# EAGLE design canbus-proto2 (EAGLE 6.4)
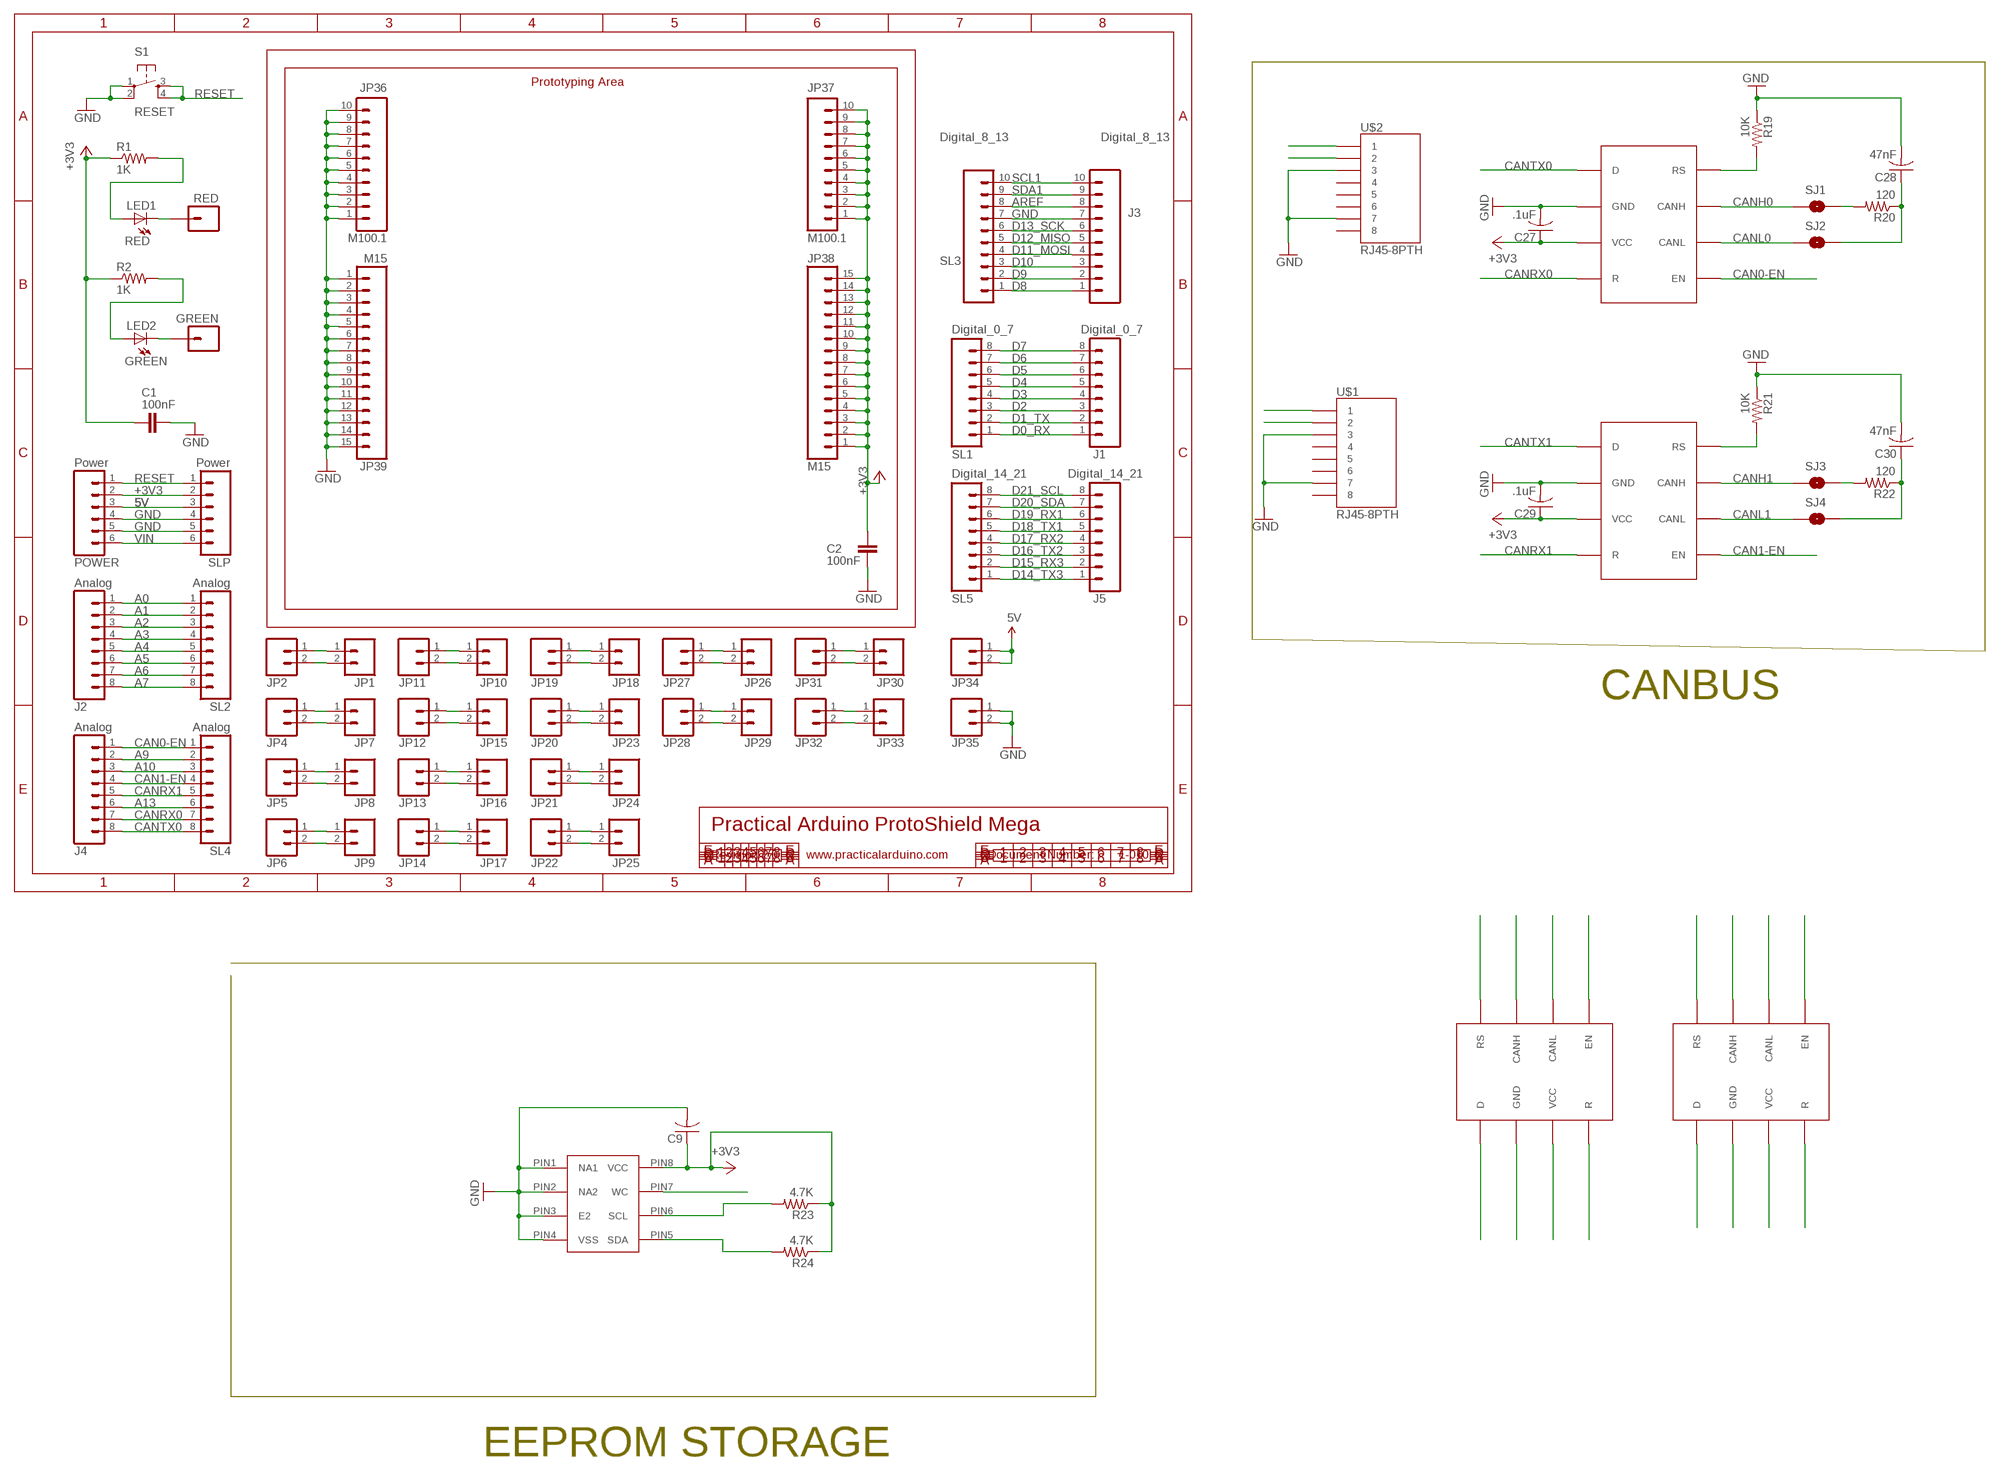
[diagram p0: schematic, sheet 1]

## Parts
C1  100nF  CAP0603-CAP  [0603-CAP]
C2  100nF  CAP0603-CAP  [0603-CAP]
C9  C-USC0603  [C0603]
C27  .1uF  C-USC0603  [C0603]
C28  47nF  C-USC0603  [C0603]
C29  .1uF  C-USC0603  [C0603]
C30  47nF  C-USC0603  [C0603]
GREEN  M01PTH  [1X01]
J1  Digital_0_7  M08  [1X08]
J2  Analog  M08  [1X08]
J3  Digital_8_13  M10"  [1X10]
J4  Analog  M08  [1X08]
J5  Digital_14_21  M08  [1X08]
JP1  M02PTH  [1X02]
JP2  M02PTH  [1X02]
JP4  M02PTH  [1X02]
JP5  M02PTH  [1X02]
JP6  M02PTH  [1X02]
JP7  M02PTH  [1X02]
JP8  M02PTH  [1X02]
JP9  M02PTH  [1X02]
JP10  M02PTH  [1X02]
JP11  M02PTH  [1X02]
JP12  M02PTH  [1X02]
JP13  M02PTH  [1X02]
JP14  M02PTH  [1X02]
JP15  M02PTH  [1X02]
JP16  M02PTH  [1X02]
JP17  M02PTH  [1X02]
JP18  M02PTH  [1X02]
JP19  M02PTH  [1X02]
JP20  M02PTH  [1X02]
JP21  M02PTH  [1X02]
JP22  M02PTH  [1X02]
JP23  M02PTH  [1X02]
JP24  M02PTH  [1X02]
JP25  M02PTH  [1X02]
JP26  M02PTH  [1X02]
JP27  M02PTH  [1X02]
JP28  M02PTH  [1X02]
JP29  M02PTH  [1X02]
JP30  M02PTH  [1X02]
JP31  M02PTH  [1X02]
JP32  M02PTH  [1X02]
JP33  M02PTH  [1X02]
JP34  M02PTH  [1X02]
JP35  M02PTH  [1X02]
JP36  M100.1  [1X10@1]
JP37  M100.1  [1X10@1]
JP38  M15  [1X15]
JP39  M15  [1X15]
LED1  RED  LED-RED0603  [LED-0603]
LED2  GREEN  LED-GREEN0603  [LED-0603]
POWER  Power  M06SIP  [1X06]
R1  1K  R-US_R0603  [R0603]
R2  1K  R-US_R0603  [R0603]
R19  10K  R-US_R0603  [R0603]
R20  120  R-US_R0603  [R0603]
R21  10K  R-US_R0603  [R0603]
R22  120  R-US_R0603  [R0603]
R23  4.7K  R-US_R0603  [R0603]
R24  4.7K  R-US_R0603  [R0603]
RED  M01PTH  [1X01]
S1  RESET  TAC_SWITCHPTH  [TACTILE-PTH]
SJ1  SOLDERJUMPERNO  [SJ_2S-NO]
SJ2  SOLDERJUMPERNO  [SJ_2S-NO]
SJ3  SOLDERJUMPERNO  [SJ_2S-NO]
SJ4  SOLDERJUMPERNO  [SJ_2S-NO]
SL1  Digital_0_7  M08  [1X08]
SL2  Analog  M08  [1X08]
SL3  Digital_8_13  M10"  [1X10]
SL4  Analog  M08  [1X08]
SL5  Digital_14_21  M08  [1X08]
SLP  Power  M06SIP  [1X06]
U$1  RJ45-8PTH  [RJ45-8]
U$2  RJ45-8PTH  [RJ45-8]
U$3  SN65HVD234  [SOIC8]
U$4  SN65HVD234  [SOIC8]
U$6  M24M02-DRMN6TP  [SOIC8]
U$7  SN65HVD234  [SOIC8]
U$8  SN65HVD234  [SOIC8]

## Nets
5V: JP34.1 JP34.2 POWER.3 SLP.3
+3V3: C1.1 C2.1 C9.1 C27.1 C29.1 JP37.1 JP37.2 JP37.3 JP37.4 JP37.5 JP37.6 JP37.7 JP37.8 JP37.9 JP37.10 JP38.1 JP38.2 JP38.3 JP38.4 JP38.5 JP38.6 JP38.7 JP38.8 JP38.9 JP38.10 JP38.11 JP38.12 JP38.13 JP38.14 JP38.15 POWER.2 R1.1 R2.1 R23.1 R24.1 SLP.2 U$6.PIN8(VCC) U$7.PIN3(VCC) U$8.PIN3(VCC)
A0: J2.1 SL2.1
A1: J2.2 SL2.2
A2: J2.3 SL2.3
A3: J2.4 SL2.4
A4: J2.5 SL2.5
A5: J2.6 SL2.6
A6: J2.7 SL2.7
A7: J2.8 SL2.8
A9: J4.2 SL4.2
A10: J4.3 SL4.3
A13: J4.6 SL4.6
AREF: J3.8 SL3.8
B1: U$3.PIN8(RS)
B2: U$3.PIN7(CANH)
B3: U$3.PIN6(CANL)
B4: U$3.PIN5(EN)
B5: U$3.PIN1(D)
B6: U$3.PIN2(GND)
B7: U$3.PIN3(VCC)
B8: U$3.PIN4(R)
B9: U$4.PIN8(RS)
B10: U$4.PIN7(CANH)
B11: U$4.PIN6(CANL)
B12: U$4.PIN5(EN)
B13: U$4.PIN4(R)
B14: U$4.PIN3(VCC)
B15: U$4.PIN2(GND)
B16: U$4.PIN1(D)
CAN0-EN: J4.1 SL4.1 U$7.PIN5(EN)
CAN1-EN: J4.4 SL4.4 U$8.PIN5(EN)
CANH0: SJ1.1 U$2.1 U$7.PIN7(CANH)
CANH1: SJ3.1 U$1.1 U$8.PIN7(CANH)
CANL0: SJ2.1 U$2.2 U$7.PIN6(CANL)
CANL1: SJ4.1 U$1.2 U$8.PIN6(CANL)
CANRX0: J4.7 SL4.7 U$7.PIN4(R)
CANRX1: J4.5 SL4.5 U$8.PIN4(R)
CANTX0: J4.8 SL4.8 U$7.PIN1(D)
CANTX1: JP32.2 JP33.2 U$8.PIN1(D)
D0_RX: J1.1 SL1.1
D1: JP10.2 JP11.2
D1_TX: J1.2 SL1.2
D2: J1.3 SL1.3
D3: J1.4 SL1.4
D4: J1.5 SL1.5
D5: J1.6 SL1.6
D6: J1.7 SL1.7
D7: J1.8 SL1.8
D8: J3.1 SL3.1
D9: J3.2 SL3.2
D10: J3.3 SL3.3
D11: JP10.1 JP11.1
D11_MOSI: J3.4 SL3.4
D12: JP18.2 JP19.2
D12_MISO: J3.5 SL3.5
D13: JP18.1 JP19.1
D13_SCK: J3.6 SL3.6
D14: JP26.2 JP27.2
D14_TX3: J5.1 SL5.1
D15: JP26.1 JP27.1
D15_RX3: J5.2 SL5.2
D16: JP30.2 JP31.2
D16_TX2: J5.3 SL5.3
D17: JP30.1 JP31.1
D17_RX2: J5.4 SL5.4
D18_TX1: J5.5 SL5.5 U$6.PIN7(WC)
D19_RX1: J5.6 SL5.6
D20_SDA: J5.7 R24.2 SL5.7 U$6.PIN5(SDA)
D21_SCL: J5.8 R23.2 SL5.8 U$6.PIN6(SCL)
D22: JP1.2 JP2.2
D23: JP1.1 JP2.1
GND: C1.2 C2.2 C9.2 C27.2 C28.2 C29.2 C30.2 J3.7 JP35.1 JP35.2 JP36.1 JP36.2 JP36.3 JP36.4 JP36.5 JP36.6 JP36.7 JP36.8 JP36.9 JP36.10 JP39.1 JP39.2 JP39.3 JP39.4 JP39.5 JP39.6 JP39.7 JP39.8 JP39.9 JP39.10 JP39.11 JP39.12 JP39.13 JP39.14 JP39.15 POWER.4 POWER.5 R19.1 R21.1 S1.1 S1.2 SL3.7 SLP.4 SLP.5 U$1.3 U$1.7 U$2.3 U$2.7 U$6.PIN1(NA1) U$6.PIN2(NA2) U$6.PIN3(E2) U$6.PIN4(VSS) U$7.PIN2(GND) U$8.PIN2(GND)
N$1: LED1.A R1.2
N$2: LED1.C RED.1
N$3: LED2.A R2.2
N$4: GREEN.1 LED2.C
N$203: R19.2 U$7.PIN8(RS)
N$337: JP4.1 JP7.1
N$338: JP4.2 JP7.2
N$339: JP5.1 JP8.1
N$340: JP5.2 JP8.2
N$341: JP6.1 JP9.1
N$342: JP6.2 JP9.2
N$343: JP12.1 JP15.1
N$344: JP12.2 JP15.2
N$345: JP13.1 JP16.1
N$346: JP13.2 JP16.2
N$347: JP14.1 JP17.1
N$348: JP14.2 JP17.2
N$349: JP20.1 JP23.1
N$350: JP20.2 JP23.2
N$351: JP21.1 JP24.1
N$352: JP21.2 JP24.2
N$353: JP22.1 JP25.1
N$354: JP22.2 JP25.2
N$355: JP28.1 JP29.1
N$356: JP28.2 JP29.2
N$357: JP32.1 JP33.1
N$359: C28.1 R20.1 SJ2.2
N$360: R20.2 SJ1.2
N$361: R21.2 U$8.PIN8(RS)
N$362: C30.1 R22.1 SJ4.2
N$363: R22.2 SJ3.2
RESET: POWER.1 S1.3 S1.4 SLP.1
SCL1: J3.10 SL3.10
SDA1: J3.9 SL3.9
VIN: POWER.6 SLP.6
Unconnected: U$1.4 U$1.5 U$1.6 U$1.8 U$2.4 U$2.5 U$2.6 U$2.8

## Notes on the sheet
- Prototyping Area
- CANBUS
- Practical Arduino ProtoShield Mega
- Revision 2.0 | www.practicalarduino.com | Document Number: | 1-010
- EEPROM STORAGE

## Library data of the parts
C1 C2 = SparkFun-Passives:CAP: Capacitor Standard 0603 ceramic capacitor, and 0.1" leaded capacitor.
C9 C27-C30 = rcl:C-US: CAPACITOR, American symbol
GREEN RED = SparkFun:M01: Header 1 Standard 1-pin 0.1" header. Use with straight break away headers (SKU : PRT-00116), right angle break away headers (PRT-00553), swiss pins (PRT-00743), machine pins (PRT-00117), and female headers (PRT-00115).
J1 J2 J4 J5 SL1 SL2 SL4 SL5 = SparkFun:M08: Header 8 Standard 8-pin 0.1" header. Use with straight break away headers (SKU : PRT-00116), right angle break away headers (PRT-00553), swiss pins (PRT-00743), machine pins (PRT-00117), and female headers (PRT-00115).
J3 SL3 = SparkFun-Connectors:M10: Header 10 Standard 10-pin 0.1" header. Use with straight break away headers (SKU : PRT-00116), right angle break away headers (PRT-00553), swiss pins (PRT-00743), machine pins (PRT-00117), and female headers (PRT-00115).
JP1 JP2 JP4-JP35 = SparkFun:M02: Header 2 Standard 2-pin 0.1" header. Use with straight break away headers (SKU : PRT-00116), right angle break away headers (PRT-00553), swiss pins (PRT-00743), machine pins (PRT-00117), and female headers (PRT-00115). Molex polarized connector foot print use with SKU : PRT-08233 with associated crimp pins and housings.
JP36 JP37 = SparkFun:M10: Header 10 Standard 10-pin 0.1" header. Use with straight break away headers (SKU : PRT-00116), right angle break away headers (PRT-00553), swiss pins (PRT-00743), machine pins (PRT-00117), and female headers (PRT-00115).
JP38 JP39 = SparkFun-Connectors:M15: Header 15 Standard 15-pin 0.1" header. Use with straight break away headers (SKU : PRT-00116), right angle break away headers (PRT-00553), swiss pins (PRT-00743), machine pins (PRT-00117), and female headers (PRT-00115).
LED1 = SparkFun-LED:LED-RED: Assorted Red LEDs LilyPad 1206- DIO-09912 1206- DIO-00809 0603- DIO-00819; PROD_ID: DIO-00819
LED2 = SparkFun-LED:LED-GREEN: Various green LEDs 0603- DIO-00821 LARGE- DIO-00862 LILYPAD- DIO-09910; PROD_ID: DIO-00821
POWER SLP = SparkFun:M06: Header 6 Standard 6-pin 0.1" header. Use with straight break away headers (SKU : PRT-00116), right angle break away headers (PRT-00553), swiss pins (PRT-00743), machine pins (PRT-00117), and female headers (PRT-00115). Molex polarized connector foot print use with SKU : PRT-08094 with associated crimp pins and housings. NOTES ON THE VARIANTS LOCK and LOCK_LONGPADS... This footprint was designed to help hold the alignment of a through-hole component (i.e. 6-pin header) while soldering it into place. You may notice that each hole has been shifted either up or down by 0.005 of an inch from it's more standard position (which is a perfectly straight line). This slight alteration caused the pins (the squares in the middle) to touch the edges of the holes. Because they are alternating, it causes a "brace" to hold the component in place. 0.005 has proven to be the perfect amount of "off-center" position when using our standard breakaway headers. Although looks a little odd when you look at the bare footprint, once you have a header in there, the alteration is very hard to notice. Also, if you push a header all the way into place, it is covered up entirely on the bottom side. This idea of altering the position of holes to aid alignment will be further integrated into the Sparkfun Library for other footprints. It can help hold any component with 3 or more connection pins.
R1 R2 R19-R24 = rcl:R-US_: RESISTOR, American symbol
S1 = SparkFun:TAC_SWITCH: Momentary Switch Button commonly used for reset or general input. Spark Fun Electronics SKU : COM-00097
SJ1-SJ4 = SparkFun-Passives:SOLDERJUMPER: Solder Jumper Standard SMD solder jumper. Used to automate production. Two varients : Normally Open and Normally Closed are the same, but have different paste layers. NC will have a large amount of paste and should jumper during reflow.
U$1 U$2 = SparkFun-Connectors:RJ45-8: RJ45 Jack Simple RJ45, 8-pin connection - connector for common Cat5, Cat5e, and Cat6 Ethernet cables. Footprint not yet proven in production. Connector sku is PRT-00643; Breakout PCB sku is BOB-00716.
U$3 U$4 U$7 U$8 = ck_custom:SN65HVD234
U$6 = ck_custom:M24M02-DRMN6TP

## Board
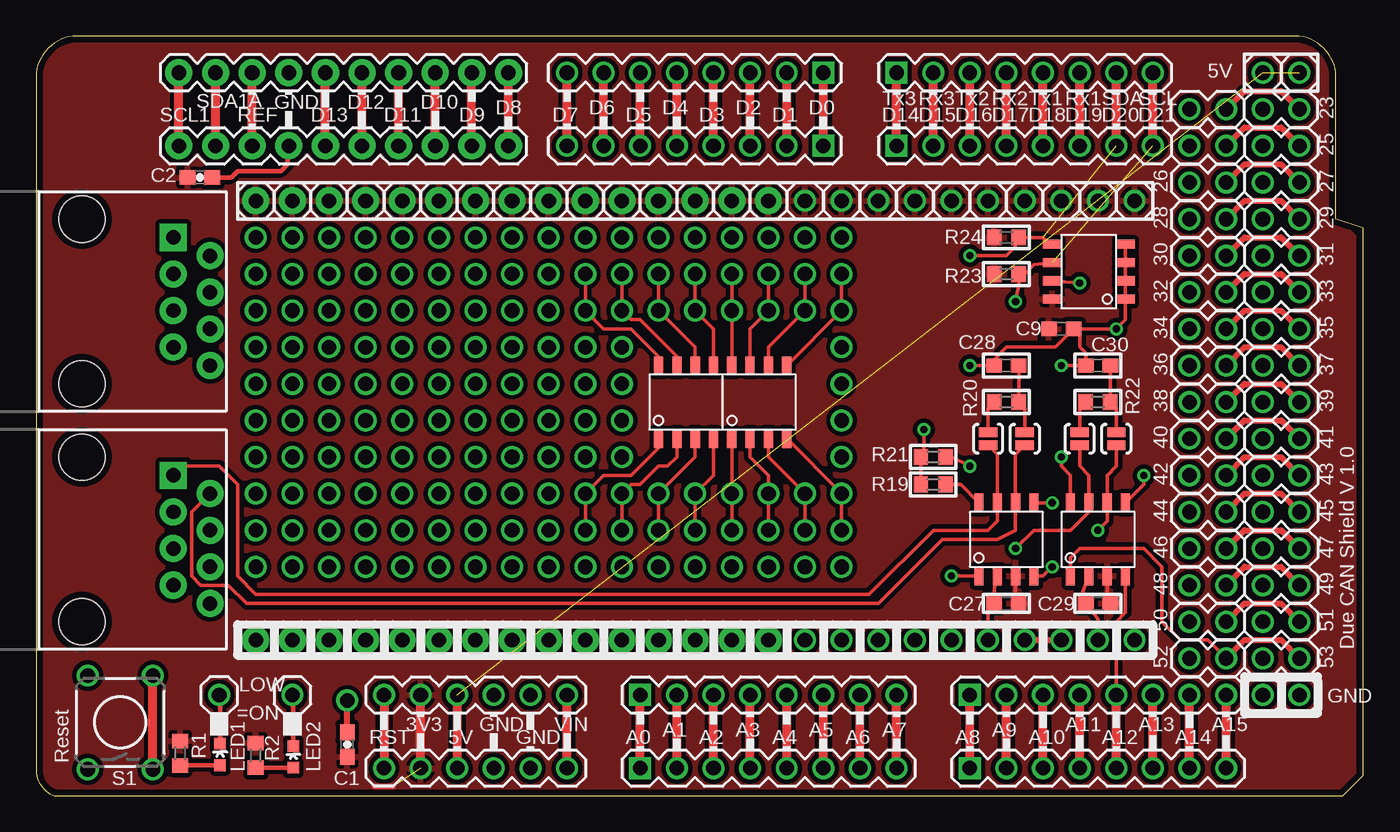
[diagram p1: board, top side]
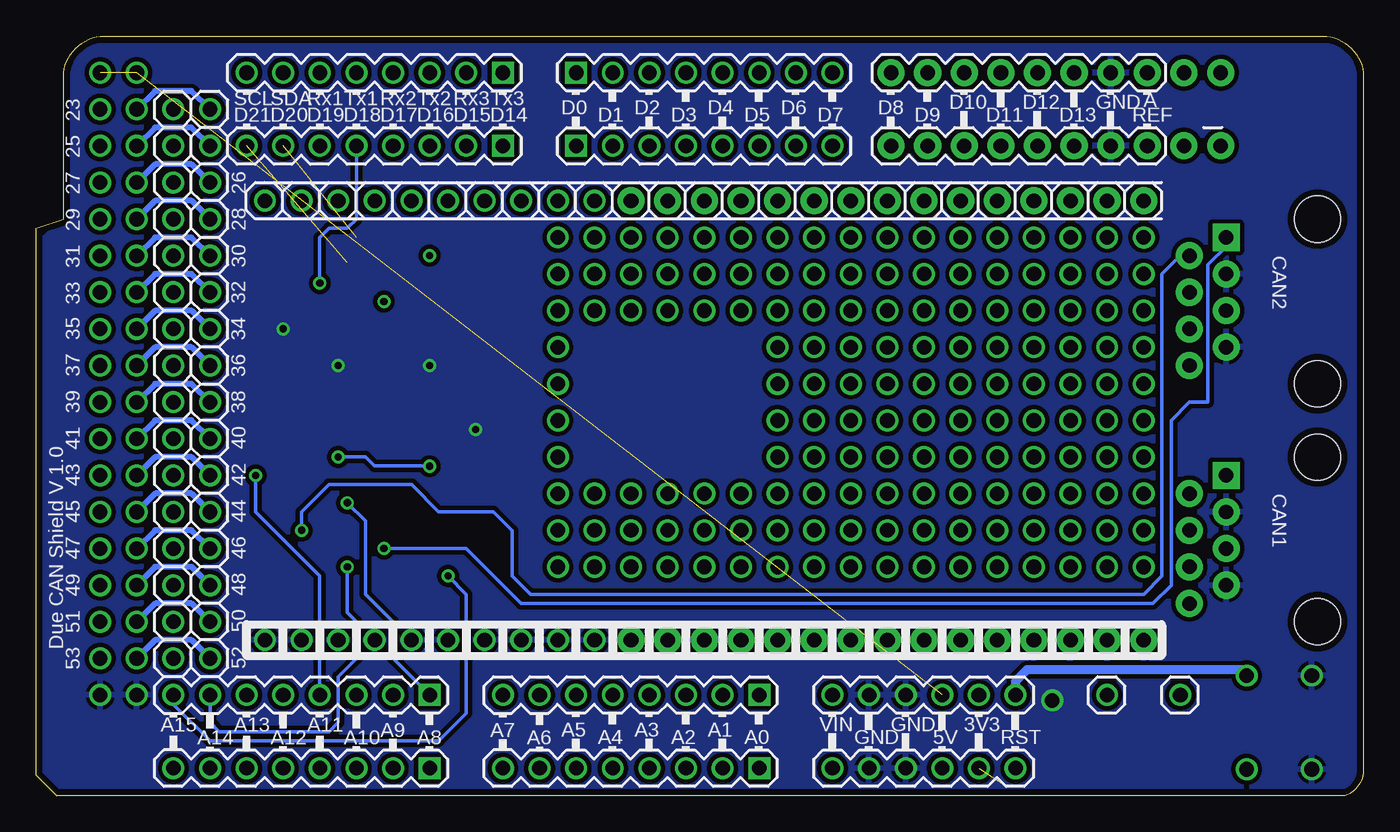
[diagram p2: board, bottom side, seen from below]

Size 92.08 x 52.71 mm. Coordinates in mm from the lower left corner, seen from the top.
Outline: 0,1.91 arc74 1.27,0 90.65,0 92.08,1.43 92.08,39.37 90.17,40.01 90.17,50.16 arc74 87.63,52.71 2.54,52.71 arc74 0,50.16 0,1.91
Copper layers (1*16): Top 0.035mm / dielectric 1.5mm / Bottom 0.035mm
Design rules "default *": minimum track width 10mil, minimum drill 24mil, track to track 12mil, track to pad 12mil, pad to pad 12mil, via to via 12mil, smd to smd 8mil, copper to edge 18mil, drill to drill 8mil, minimum pad ring 10mil, minimum via ring 8mil, stop-mask expansion 4mil, vias tented up to drill 0mil, thermal gap 10mil

### Footprints (pad centres in the part's own frame; a part is rotated, then mirrored left to right if it is on the bottom)
0603-CAP = smd 1.1 x 1: 1 -0.85,0; 2 0.85,0
C0603 = smd 1.1 x 1: 1 -0.85,0; 2 0.85,0
1X01 = drill 1.016: 1 0,0
1X08 = drill 1.016 square: 1 0,0 | drill 1.016: 2 2.54,0; 3 5.08,0; 4 7.62,0; 5 10.16,0; 6 12.7,0; 7 15.24,0; 8 17.78,0
1X10 = drill 1.016 pad 1.88: 1 0,0; 2 2.54,0; 3 5.08,0; 4 7.62,0; 5 10.16,0; 6 12.7,0; 7 15.24,0; 8 17.78,0; 9 20.32,0; 10 22.86,0
1X02 = drill 1.016: 1 0,0; 2 2.54,0
1X10' = drill 1.016: 1 0,0; 2 2.54,0; 3 5.08,0; 4 7.62,0; 5 10.16,0; 6 12.7,0; 7 15.24,0; 8 17.78,0; 9 20.32,0; 10 22.86,0
1X15 = drill 1.016 pad 1.88: 1 0,0; 2 2.54,0; 3 5.08,0; 4 7.62,0; 5 10.16,0; 6 12.7,0; 7 15.24,0; 8 17.78,0; 9 20.32,0; 10 22.86,0; 11 25.4,0; 12 27.94,0; 13 30.48,0; 14 33.02,0; 15 35.56,0
LED-0603 = smd 0.8 x 0.8: A 0,-0.75; C 0,0.75
1X06 = drill 1.016: 1 0,0; 2 2.54,0; 3 5.08,0; 4 7.62,0; 5 10.16,0; 6 12.7,0
R0603 = smd 1 x 1.1: 1 -0.85,0; 2 0.85,0
TACTILE-PTH = drill 1.016: 1 -3.251,2.261; 2 3.251,2.261; 3 -3.251,-2.261; 4 3.251,-2.261
SJ_2S-NO = smd 0.635 x 1.27: 1 -0.45,0; 2 0.45,0
RJ45-8 = drill 1 pad 1.88 square: 1 -4.445,6.35 | drill 1 pad 1.88: 2 -3.175,8.89; 3 -1.905,6.35; 4 -0.635,8.89; 5 0.635,6.35; 6 1.905,8.89; 7 3.175,6.35; 8 4.445,8.89 | hole 3.2: -5.715,0; 5.715,0
SOIC8 = smd 0.635 x 1.27: PIN1 0.635,-0.635; PIN2 1.905,-0.635; PIN3 3.175,-0.635; PIN4 4.445,-0.635; PIN5 4.445,4.445; PIN6 3.175,4.445; PIN7 1.905,4.445; PIN8 0.635,4.445

### Placement (x,y rotation side)
C1  21.59,3.56 90 top
C2  11.37,42.89 0 top
C9  71.12,32.39 0 top
C27  67.31,13.34 180 top
C28  67.31,29.84 180 top
C29  73.66,13.34 180 top
C30  73.66,29.84 180 top
GREEN  17.78,6.99 0 top
J1  54.61,50.16 180 top
J2  41.91,1.91 0 top
J3  32.77,50.16 180 top
J4  64.77,6.99 0 top
J5  59.69,50.16 0 top
JP1  87.63,47.62 180 top
JP2  82.55,47.62 180 top
JP4  80.01,45.09 0 top
JP5  80.01,42.55 0 top
JP6  80.01,40.01 0 top
JP7  85.09,45.09 0 top
JP8  85.09,42.55 0 top
JP9  85.09,40.01 0 top
JP10  80.01,37.47 0 top
JP11  85.09,37.47 0 top
JP12  80.01,34.93 0 top
JP13  80.01,32.39 0 top
JP14  80.01,29.84 0 top
JP15  85.09,34.93 0 top
JP16  85.09,32.39 0 top
JP17  85.09,29.84 0 top
JP18  80.01,27.3 0 top
JP19  85.09,27.3 0 top
JP20  80.01,24.76 0 top
JP21  80.01,22.22 0 top
JP22  80.01,19.68 0 top
JP23  85.09,24.76 0 top
JP24  85.09,22.22 0 top
JP25  85.09,19.68 0 top
JP26  80.01,17.14 0 top
JP27  85.09,17.14 0 top
JP28  80.01,14.61 0 top
JP29  85.09,14.61 0 top
JP30  80.01,12.06 0 top
JP31  85.09,12.06 0 top
JP32  80.01,9.53 0 top
JP33  85.09,9.53 0 top
JP34  85.09,50.16 0 top
JP35  85.09,6.99 0 top
JP36  M100.1  [1X10']  53.34,10.79 0 top
JP37  M100.1  [1X10']  53.34,41.27 0 top
JP38  15.24,41.27 0 top
JP39  15.24,10.79 0 top
LED1  12.77,2.86 0 top
LED2  17.85,2.7 0 top
POWER  24.13,1.91 0 top
R1  10,2.95 270 top
R2  15.24,2.79 270 top
R19  62.23,21.59 0 top
R20  67.31,27.3 180 top
R21  62.23,23.49 0 top
R22  73.66,27.3 180 top
R23  67.31,36.2 0 top
R24  67.31,38.73 0 top
RED  12.7,6.99 0 top
S1  5.84,5.08 90 top
SJ1  66.04,24.76 90 top
SJ2  68.58,24.76 90 top
SJ3  72.39,24.76 90 top
SJ4  74.93,24.76 90 top
SL1  54.61,45.09 180 top
SL2  41.91,6.99 0 top
SL3  32.77,45.09 180 top
SL4  64.77,1.91 0 top
SL5  59.69,45.09 0 top
SLP  24.13,6.99 0 top
U$1  3.18,34.29 270 top
U$2  3.18,17.78 270 top
U$3  47.63,25.4 0 top
U$4  42.55,25.4 0 top
U$6  74.93,33.81 90 top
U$7  64.77,15.88 0 top
U$8  71.12,15.88 0 top

### Tracks (layer width: path | path; a pad name or v marks a point on that pad's centre or on a via)
5V  (2 unrouted)
  Top 0.61: SLP.3 POWER.3
+3V3  (1 unrouted)
  Top 0.254: C29.1 74.3,13.55 U$8.PIN3 | U$7.PIN3 67.95,13.34
  Top 0.406: 23.5,0.64 24.77,0.64
  Top 0.61: POWER.2 SLP.2
  pour Top: 0,50.16 arc-74 2.54,52.71 87.63,52.71 arc-74 90.17,50.16 90.17,40.01 92.71,37.47 92.71,4.45 92.55,0.95 arc-74 87.63,-0.64 2.54,-0.64 arc-74 0,1.91
A0
  Top 0.61: J2.1 SL2.1
A1
  Top 0.61: J2.2 SL2.2
A2
  Top 0.61: J2.3 SL2.3
A3
  Top 0.61: J2.4 SL2.4
A4
  Top 0.61: J2.5 SL2.5
A5
  Top 0.61: J2.6 SL2.6
A6
  Top 0.61: J2.7 SL2.7
A7
  Top 0.61: J2.8 SL2.8
A9
  Top 0.61: SL4.2 J4.2
A10
  Top 0.61: SL4.3 J4.3
A13
  Top 0.61: SL4.6 J4.6
AREF
  Top 0.61: SL3.8 J3.8
B1  (via drill 1.02)
  Top 0.254: U$3.PIN8 v48.26,33.66 v48.26,36.2
B2  (via drill 1.02)
  Top 0.254: U$3.PIN7 49.53,32.39 v50.8,33.66 v50.8,36.2
B3  (via drill 1.02)
  Top 0.254: U$3.PIN6 50.8,31.11 v53.34,33.66 v53.34,36.2
B4  (via drill 1.02)
  Top 0.254: U$3.PIN5 v55.88,33.66 v55.88,36.2
B5  (via drill 1.02)
  Top 0.254: U$3.PIN1 v48.26,20.95 v48.26,18.41
B6  (via drill 1.02)
  Top 0.254: U$3.PIN2 49.53,23.49 50.8,22.22 v50.8,20.95 v50.8,18.41
B7  (via drill 1.02)
  Top 0.254: U$3.PIN3 50.8,23.49 v53.34,20.95 v53.34,18.41
B8  (via drill 1.02)
  Top 0.254: U$3.PIN4 v55.88,20.95 v55.88,18.41
B9  (via drill 1.02)
  Top 0.254: U$4.PIN8 43.18,30.48 41.28,32.39 39.37,32.39 v38.1,33.66 v38.1,36.2
B10  (via drill 1.02)
  Top 0.254: U$4.PIN7 44.45,30.48 41.91,33.02 41.28,33.02 v40.64,33.66 v40.64,36.2
B11  (via drill 1.02)
  Top 0.254: U$4.PIN6 45.72,31.11 v43.18,33.66 v43.18,36.2
B12  (via drill 1.02)
  Top 0.254: U$4.PIN5 46.99,32.39 v45.72,33.66 v45.72,36.2
B13  (via drill 1.02)
  Top 0.254: U$4.PIN4 46.99,22.22 v45.72,20.95 v45.72,18.41
B14  (via drill 1.02)
  Top 0.254: U$4.PIN3 45.72,23.49 v43.18,20.95 v43.18,18.41
B15  (via drill 1.02)
  Top 0.254: U$4.PIN2 44.45,23.49 43.82,22.86 43.18,22.86 41.91,21.59 41.28,21.59 v40.64,20.95 v40.64,18.41
B16  (via drill 1.02)
  Top 0.254: U$4.PIN1 43.18,24.13 41.28,22.22 39.37,22.22 v38.1,20.95 v38.1,18.41
CAN0-EN  (via drill 0.5)
  Top 0.254: v70.49,20.32 U$7.PIN5
  Top 0.61: SL4.1 J4.1
  Bottom 0.254: J4.1 67.31,9.53 67.31,12.06 69.22,13.97 69.22,19.05 v70.49,20.32
CAN1-EN  (via drill 0.5)
  Top 0.254: v76.84,22.22 76.84,21.59 U$8.PIN5
  Top 0.61: SL4.4 J4.4
  Bottom 0.254: J4.4 72.39,15.24 76.84,19.68 v76.84,22.22
CANH0
  Top 0.254: SJ1.1 66.68,23.68 U$7.PIN7 66.68,19.05 66.04,18.41 62.23,18.41 57.79,13.97 15.24,13.97 13.97,15.24 13.97,21.59 12.7,22.86 10.16,22.86 U$2.1
CANH1  (via drill 0.5)
  Top 0.254: SJ3.1 72.39,22.86 73.03,22.22 U$8.PIN7 73.03,19.68 71.76,18.41 69.22,18.41 v67.95,17.14
  Bottom 0.254: v67.95,17.14 62.23,17.14 58.42,13.34 14.61,13.34 13.34,14.61 13.34,26.04 12.07,27.3 10.8,27.3 10.8,36.83 9.53,38.1 U$1.1
CANL0
  Top 0.254: SJ2.1 67.95,23.68 U$7.PIN6 67.95,18.41 66.68,17.78 62.87,17.78 58.42,13.34 14.61,13.34 13.34,14.61 11.43,14.61 10.8,15.24 10.8,19.68 U$2.2
CANL1  (via drill 0.5)
  Top 0.254: SJ4.1 74.93,22.86 74.3,22.22 U$8.PIN6 74.3,19.05 v73.66,18.41
  Bottom 0.254: U$1.2 12.7,37.47 13.97,36.2 13.97,15.24 15.24,13.97 57.79,13.97 59.06,15.24 59.06,18.41 60.33,19.68 64.14,19.68 66.04,21.59 71.76,21.59 73.66,19.68 v73.66,18.41
CANRX0  (via drill 0.5)
  Top 0.254: U$7.PIN4 69.85,15.24 v70.49,15.88
  Top 0.61: SL4.7 J4.7
  Bottom 0.254: v70.49,15.88 70.49,12.7 69.85,12.06 69.85,9.53 71.12,8.26 71.12,5.08 71.76,4.45 79.38,4.45 80.01,5.08 J4.7
CANRX1
  Top 0.254: J4.5 74.93,12.06 75.57,12.7 U$8.PIN4
  Top 0.61: SL4.5 J4.5
CANTX0  (via drill 0.5)
  Top 0.254: U$7.PIN1 v63.5,15.24
  Top 0.61: SL4.8 J4.8
  Bottom 0.254: J4.8 82.55,6.35 80.01,3.81 64.14,3.81 62.23,5.71 62.23,13.97 v63.5,15.24
CANTX1
  Top 0.254: U$8.PIN1 71.76,16.51 72.39,17.14 76.84,17.14 78.11,15.88 78.11,12.06 79.38,10.79 81.28,10.79 JP32.2
  Top 0.406: JP32.2 83.82,10.79 86.36,10.79 JP33.2
D0_RX
  Top 0.61: SL1.1 J1.1
D1
  Top 0.406: JP10.2 83.82,38.73 86.36,38.73 JP11.2
D1_TX
  Top 0.61: SL1.2 J1.2
D2
  Top 0.61: SL1.3 J1.3
D3
  Top 0.61: SL1.4 J1.4
D4
  Top 0.61: SL1.5 J1.5
D5
  Top 0.61: SL1.6 J1.6
D6
  Top 0.61: SL1.7 J1.7
D7
  Top 0.61: SL1.8 J1.8
D8
  Top 0.61: SL3.1 J3.1
D9
  Top 0.61: SL3.2 J3.2
D10
  Top 0.61: SL3.3 J3.3
D11
  Bottom 0.406: JP10.1 81.28,38.73 83.82,38.73 JP11.1
D11_MOSI
  Top 0.61: SL3.4 J3.4
D12
  Top 0.406: JP19.2 86.36,28.57 83.82,28.57 JP18.2
D12_MISO
  Top 0.61: SL3.5 J3.5
D13
  Bottom 0.406: JP18.1 81.28,28.57 83.82,28.57 JP19.1
D13_SCK
  Top 0.61: SL3.6 J3.6
D14
  Top 0.406: JP27.2 86.36,18.41 83.82,18.41 JP26.2
D14_TX3
  Top 0.61: SL5.1 J5.1
D15
  Bottom 0.406: JP26.1 81.28,18.41 83.82,18.41 JP27.1
D15_RX3
  Top 0.61: SL5.2 J5.2
D16
  Top 0.406: JP31.2 86.36,13.34 83.82,13.34 JP30.2
D16_TX2
  Top 0.61: SL5.3 J5.3
D17
  Bottom 0.406: JP30.1 81.28,13.34 83.82,13.34 JP31.1
D17_RX2
  Top 0.61: SL5.4 J5.4
D18_TX1  (via drill 0.5)
  Top 0.254: U$6.PIN7 v72.39,35.56
  Top 0.61: SL5.5 J5.5
  Bottom 0.254: v72.39,35.56 72.39,38.73 71.76,39.37 70.49,39.37 69.85,40.01 SL5.5
D19_RX1
  Top 0.61: SL5.6 J5.6
D20_SDA  (via drill 0.5)  (1 unrouted)
  Top 0.254: U$6.PIN5 69.85,38.73 R24.2 67.95,38.52 67.95,38.1 67.31,37.47 v64.77,37.47
  Top 0.61: SL5.7 J5.7
D21_SCL  (via drill 0.5)  (1 unrouted)
  Top 0.254: U$6.PIN6 69.22,36.83 68.58,36.2 R23.2 68.16,35.46 v67.95,34.29
  Top 0.61: SL5.8 J5.8
D22
  Bottom 0.406: JP2.2 81.28,48.9 83.82,48.9 JP1.2
D23
  Top 0.406: JP1.1 86.36,48.9 83.82,48.9 JP2.1
GND  (via drill 0.5, 1.02)
  Top 0.254: U$6.PIN4 U$6.PIN3 U$6.PIN2 U$6.PIN1 75.57,33.02 v74.93,32.39 C9.2 | C30.2 72.81,30.69 72.39,31.11 72.39,31.96 C9.2 | C28.2 66.46,30.26 67.31,31.11 70.7,31.11 C9.2 | JP36.9 73.66,12.28 C29.2 72.61,14.19 U$8.PIN2 | JP36.6 66.04,13.12 C27.2 66.46,14.39 U$7.PIN2 | v61.6,25.4 61.6,23.71 R21.1 R19.1 | v64.77,29.84 66.68,29.84 | v71.12,29.84 73.03,29.84
  Top 0.305: C2.2 13.53,42.89 13.97,43.34 16.99,43.34 17.46,43.82 17.46,45.02 SL3.7
  Top 0.406: C1.2 v21.59,6.6 | JP36.7 JP36.8
  other vias: 58.42,10.79
  pour Bottom: 0,50.16 arc-74 2.54,52.71 87.63,52.71 arc-74 90.17,50.16 90.17,40.01 92.71,37.47 92.71,4.45 92.55,0.95 arc-74 87.63,-0.64 2.54,-0.64 arc-90 0,1.91
N$1
  Top 0.305: LED1.A 10.8,2.11 R1.2
N$2
  Top 0.305: LED1.C 12.77,6.92 RED.1
N$3
  Top 0.305: LED2.A R2.2
N$4
  Top 0.305: LED2.C 17.84,6.92 GREEN.1
N$22  (via drill 1.02)
  other vias: 50.8,15.88
N$23  (via drill 1.02)
  other vias: 48.26,15.88
N$24  (via drill 1.02)
  other vias: 45.72,15.88
N$25  (via drill 1.02)
  other vias: 43.18,15.88
N$26  (via drill 1.02)
  other vias: 40.64,15.88
N$27  (via drill 1.02)
  other vias: 38.1,15.88
N$28  (via drill 1.02)
  other vias: 35.56,15.88
N$29  (via drill 1.02)
  other vias: 33.02,15.88
N$30  (via drill 1.02)
  other vias: 30.48,15.88
N$31  (via drill 1.02)
  other vias: 27.94,15.88
N$32  (via drill 1.02)
  other vias: 25.4,15.88
N$33  (via drill 1.02)
  other vias: 22.86,15.88
N$34  (via drill 1.02)
  other vias: 20.32,15.88
N$35  (via drill 1.02)
  other vias: 17.78,15.88
N$36  (via drill 1.02)
  other vias: 15.24,15.88
N$44  (via drill 1.02)
  other vias: 35.56,18.41
N$45  (via drill 1.02)
  other vias: 33.02,18.41
N$46  (via drill 1.02)
  other vias: 30.48,18.41
N$47  (via drill 1.02)
  other vias: 27.94,18.41
N$48  (via drill 1.02)
  other vias: 25.4,18.41
N$49  (via drill 1.02)
  other vias: 22.86,18.41
N$50  (via drill 1.02)
  other vias: 20.32,18.41
N$51  (via drill 1.02)
  other vias: 17.78,18.41
N$52  (via drill 1.02)
  other vias: 15.24,18.41
N$60  (via drill 1.02)
  other vias: 35.56,20.95
N$61  (via drill 1.02)
  other vias: 33.02,20.95
N$62  (via drill 1.02)
  other vias: 30.48,20.95
N$63  (via drill 1.02)
  other vias: 27.94,20.95
N$64  (via drill 1.02)
  other vias: 25.4,20.95
N$65  (via drill 1.02)
  other vias: 22.86,20.95
N$66  (via drill 1.02)
  other vias: 20.32,20.95
N$67  (via drill 1.02)
  other vias: 17.78,20.95
N$68  (via drill 1.02)
  other vias: 15.24,20.95
N$74  (via drill 1.02)
  other vias: 40.64,23.49
N$75  (via drill 1.02)
  other vias: 38.1,23.49
N$76  (via drill 1.02)
  other vias: 35.56,23.49
N$77  (via drill 1.02)
  other vias: 33.02,23.49
N$78  (via drill 1.02)
  other vias: 30.48,23.49
N$79  (via drill 1.02)
  other vias: 27.94,23.49
N$80  (via drill 1.02)
  other vias: 25.4,23.49
N$81  (via drill 1.02)
  other vias: 22.86,23.49
N$82  (via drill 1.02)
  other vias: 20.32,23.49
N$83  (via drill 1.02)
  other vias: 17.78,23.49
N$84  (via drill 1.02)
  other vias: 15.24,23.49
N$90  (via drill 1.02)
  other vias: 40.64,26.04
N$91  (via drill 1.02)
  other vias: 38.1,26.04
N$92  (via drill 1.02)
  other vias: 35.56,26.04
N$93  (via drill 1.02)
  other vias: 33.02,26.04
N$94  (via drill 1.02)
  other vias: 30.48,26.04
N$95  (via drill 1.02)
  other vias: 27.94,26.04
N$96  (via drill 1.02)
  other vias: 25.4,26.04
N$97  (via drill 1.02)
  other vias: 22.86,26.04
N$98  (via drill 1.02)
  other vias: 20.32,26.04
N$99  (via drill 1.02)
  other vias: 17.78,26.04
N$100  (via drill 1.02)
  other vias: 15.24,26.04
N$106  (via drill 1.02)
  other vias: 40.64,28.57
N$107  (via drill 1.02)
  other vias: 38.1,28.57
N$108  (via drill 1.02)
  other vias: 35.56,28.57
N$109  (via drill 1.02)
  other vias: 33.02,28.57
N$110  (via drill 1.02)
  other vias: 30.48,28.57
N$111  (via drill 1.02)
  other vias: 27.94,28.57
N$112  (via drill 1.02)
  other vias: 25.4,28.57
N$113  (via drill 1.02)
  other vias: 22.86,28.57
N$114  (via drill 1.02)
  other vias: 20.32,28.57
N$115  (via drill 1.02)
  other vias: 17.78,28.57
N$116  (via drill 1.02)
  other vias: 15.24,28.57
N$122  (via drill 1.02)
  other vias: 40.64,31.11
N$123  (via drill 1.02)
  other vias: 38.1,31.11
N$124  (via drill 1.02)
  other vias: 35.56,31.11
N$125  (via drill 1.02)
  other vias: 33.02,31.11
N$126  (via drill 1.02)
  other vias: 30.48,31.11
N$127  (via drill 1.02)
  other vias: 27.94,31.11
N$128  (via drill 1.02)
  other vias: 25.4,31.11
N$129  (via drill 1.02)
  other vias: 22.86,31.11
N$130  (via drill 1.02)
  other vias: 20.32,31.11
N$131  (via drill 1.02)
  other vias: 17.78,31.11
N$132  (via drill 1.02)
  other vias: 15.24,31.11
N$140  (via drill 1.02)
  other vias: 35.56,33.66
N$141  (via drill 1.02)
  other vias: 33.02,33.66
N$142  (via drill 1.02)
  other vias: 30.48,33.66
N$143  (via drill 1.02)
  other vias: 27.94,33.66
N$144  (via drill 1.02)
  other vias: 25.4,33.66
N$145  (via drill 1.02)
  other vias: 22.86,33.66
N$146  (via drill 1.02)
  other vias: 20.32,33.66
N$147  (via drill 1.02)
  other vias: 17.78,33.66
N$148  (via drill 1.02)
  other vias: 15.24,33.66
N$150  (via drill 1)
  other vias: 55.88,38.73
N$156  (via drill 1.02)
  other vias: 35.56,36.2
N$157  (via drill 1.02)
  other vias: 33.02,36.2
N$158  (via drill 1.02)
  other vias: 30.48,36.2
N$159  (via drill 1.02)
  other vias: 27.94,36.2
N$160  (via drill 1.02)
  other vias: 25.4,36.2
N$161  (via drill 1.02)
  other vias: 22.86,36.2
N$162  (via drill 1.02)
  other vias: 20.32,36.2
N$163  (via drill 1.02)
  other vias: 17.78,36.2
N$164  (via drill 1.02)
  other vias: 15.24,36.2
N$166  (via drill 1.02)
  other vias: 50.8,38.73
N$167  (via drill 1.02)
  other vias: 48.26,38.73
N$168  (via drill 1.02)
  other vias: 45.72,38.73
N$169  (via drill 1.02)
  other vias: 43.18,38.73
N$170  (via drill 1.02)
  other vias: 40.64,38.73
N$171  (via drill 1.02)
  other vias: 38.1,38.73
N$172  (via drill 1.02)
  other vias: 35.56,38.73
N$173  (via drill 1.02)
  other vias: 33.02,38.73
N$174  (via drill 1.02)
  other vias: 30.48,38.73
N$175  (via drill 1.02)
  other vias: 27.94,38.73
N$176  (via drill 1.02)
  other vias: 25.4,38.73
N$177  (via drill 1.02)
  other vias: 22.86,38.73
N$178  (via drill 1.02)
  other vias: 20.32,38.73
N$179  (via drill 1.02)
  other vias: 17.78,38.73
N$180  (via drill 1.02)
  other vias: 15.24,38.73
N$183  (via drill 1.02)
  other vias: 53.34,15.88
N$192  (via drill 1.02)
  other vias: 53.34,38.73
N$194  (via drill 1.02)
  other vias: 55.88,15.88
N$197  (via drill 1.02)
  other vias: 55.88,23.49
N$198  (via drill 1.02)
  other vias: 55.88,26.04
N$199  (via drill 1.02)
  other vias: 55.88,28.57
N$200  (via drill 1.02)
  other vias: 55.88,31.11
N$203
  Top 0.254: R19.2 64.14,21.59 U$7.PIN8
N$337
  Bottom 0.406: JP4.1 81.28,46.36 83.82,46.36 JP7.1
N$338
  Top 0.406: JP7.2 86.36,46.36 83.82,46.36 JP4.2
N$339
  Bottom 0.406: JP5.1 81.28,43.82 83.82,43.82 JP8.1
N$340
  Top 0.406: JP8.2 86.36,43.82 83.82,43.82 JP5.2
N$341
  Bottom 0.406: JP6.1 81.28,41.27 83.82,41.27 JP9.1
N$342
  Top 0.406: JP9.2 86.36,41.27 83.82,41.27 JP6.2
N$343
  Bottom 0.406: JP12.1 81.28,36.2 83.82,36.2 JP15.1
N$344
  Top 0.406: JP15.2 86.36,36.2 83.82,36.2 JP12.2
N$345
  Bottom 0.406: JP13.1 81.28,33.66 83.82,33.66 JP16.1
N$346
  Top 0.406: JP13.2 83.82,33.66 86.36,33.66 JP16.2
N$347
  Bottom 0.406: JP14.1 81.28,31.11 83.82,31.11 JP17.1
N$348
  Top 0.406: JP17.2 86.36,31.11 83.82,31.11 JP14.2
N$349
  Bottom 0.406: JP20.1 81.28,26.04 83.82,26.04 JP23.1
N$350
  Top 0.406: JP23.2 86.36,26.04 83.82,26.04 JP20.2
N$351
  Bottom 0.406: JP21.1 81.28,23.49 83.82,23.49 JP24.1
N$352
  Top 0.406: JP24.2 86.36,23.49 83.82,23.49 JP21.2
N$353
  Bottom 0.406: JP22.1 81.28,20.95 83.82,20.95 JP25.1
N$354
  Top 0.406: JP25.2 86.36,20.95 83.82,20.95 JP22.2
N$355
  Bottom 0.406: JP28.1 81.28,15.88 83.82,15.88 JP29.1
N$356
  Top 0.406: JP28.2 83.82,15.88 86.36,15.88 JP29.2
N$357
  Bottom 0.406: JP32.1 81.28,10.79 83.82,10.79 JP33.1
N$359
  Top 0.254: C28.1 R20.1 68.58,26.88 SJ2.2
N$360
  Top 0.254: SJ1.2 66.04,26.88 R20.2
N$361  (via drill 0.5)
  Top 0.254: R21.2 63.5,23.49 v64.77,22.86 | v71.12,23.49 71.12,22.86 71.76,22.22 U$8.PIN8
  Bottom 0.254: v64.77,22.86 68.58,22.86 69.22,23.49 v71.12,23.49
N$362
  Top 0.254: SJ4.2 74.93,26.88 R22.1 C30.1
N$363
  Top 0.254: SJ3.2 72.39,26.88 R22.2
RESET
  Top 0.61: SLP.1 POWER.1 | S1.3 S1.4
  Bottom 0.61: S1.4 8.5,8.73 23.34,8.73 24.13,7.94 SLP.1
SCL1
  Top 0.61: SL3.10 J3.10
SDA1
  Top 0.61: SL3.9 J3.9
VIN
  Top 0.61: POWER.6 SLP.6

### Text on the board
tPlace: 5V | Tx3 | Rx3 | Tx2 | Rx2 | Tx1 | Rx1 | SDA | SCL | SDA1 | A | GND | D12 | D10 | D8 | D6 | D4 | D2 | D0 | 23 | SCL1 | REF | D13 | D11 | D9 | D7 | D5 | D3 | D1 | D14 | D15 | D16 | D17 | D18 | D19 | D20 | D21 | 25 | 26 | 27 | 28 | 29 | 30 | 31 | 32 | 33 | 34 | 35 | 36 | 37 | 38 | 39 | 40 | 41 | 42 | 43 | 44 | 45 | 46 | 47 | 48 | 49 | 50 | 51 | Due CAN Shield V 1.0 | 52 | 53 | LOW | GND | =ON | 3V3 | GND | VIN | A1 | A3 | A5 | A7 | A9 | A11 | A13 | A15 | RST | 5V | GND | A0 | A2 | A4 | A6 | A8 | A10 | A12 | A14 | Reset
bPlace: Tx3 | Rx3 | Tx2 | Rx2 | Tx1 | Rx1 | SDA | SCL | 23 | A | GND | D12 | D10 | D8 | D6 | D4 | D2 | D0 | REF | D13 | D11 | D9 | D7 | D5 | D3 | D1 | D14 | D15 | D16 | D17 | D18 | D19 | D20 | D21 | 25 | 26 | 27 | 28 | 29 | 30 | 31 | CAN2 | 32 | 33 | 34 | 35 | 36 | 37 | 38 | 39 | 40 | 41 | 42 | 43 | CAN1 | 44 | 45 | 46 | 47 | 48 | 49 | 50 | 51 | 52 | 53 | Due CAN Shield V 1.0 | 3V3 | GND | VIN | A1 | A3 | A5 | A7 | A9 | A11 | A13 | A15 | RST | 5V | GND | A0 | A2 | A4 | A6 | A8 | A10 | A12 | A14